# Altium schematic sheet BuzzerCircuit.SchDoc
size A
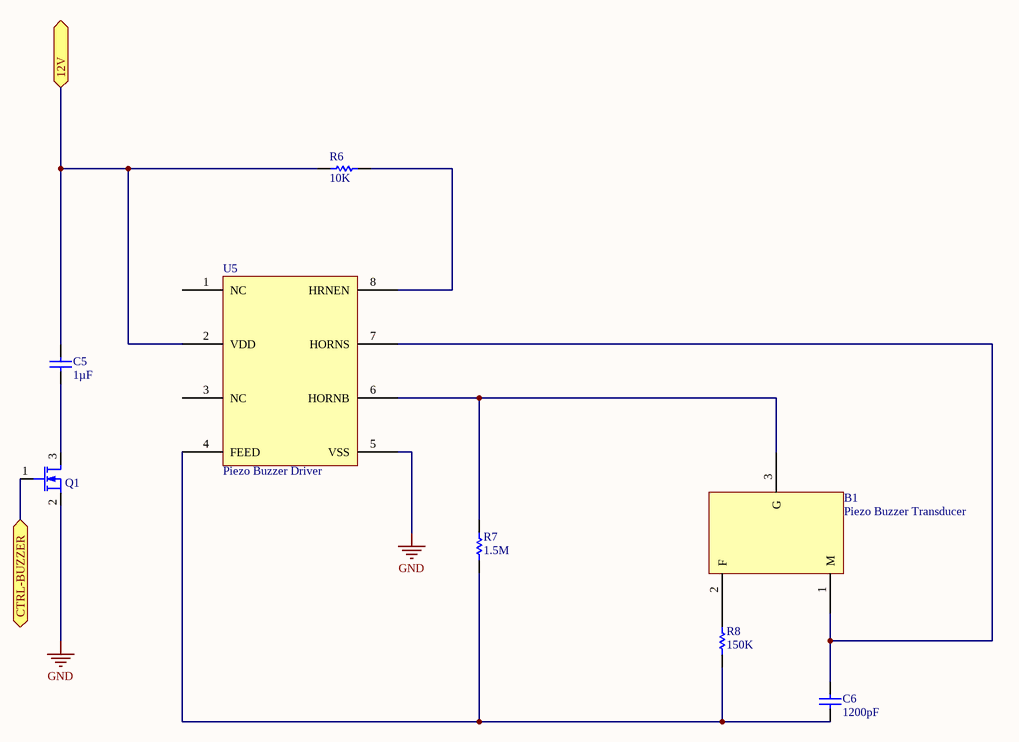
[diagram p0: BuzzerCircuit.SchDoc]

## Parts
B1  Piezo Buzzer Transducer  [2017 Buzzer]
C5  1µF  [0603]
C6  1200pF  [0603]
Q1  NMOS - MTM232270LBF  [MTM232270LBF]  (value not drawn)
R6  10K  [0603]
R7  1.5M  [0603]
R8  150K  [0603]
U5  Piezo Buzzer Driver  [Buzzer Driver]

## Ports
12V, CTRL-BUZZER

## Nets
GND: Q1.2 U5.5(VSS)
12V: C5.2 R6.1 U5.2(VDD) ; port 12V
CTRL-BUZZER: Q1.1 ; port CTRL-BUZZER
NetB1_1: B1.1(M) C6.2 U5.7(HORNS)
NetB1_2: B1.2(F) R8.2
NetB1_3: B1.3(G) R7.2 U5.6(HORNB)
NetC5_1: C5.1 Q1.3
NetC6_1: C6.1 R7.1 R8.1 U5.4(FEED)
NetR6_2: R6.2 U5.8(HRNEN)

Not connected (* = marked no-connect by the designer): U5 1(NC) 3(NC)

## Library data of the parts
C5 C6 = Cap: Capacitor; Published: 8-Jun-2000; LatestRevisionDate: 17-Jul-2002; LatestRevisionNote: Re-released for DXP Platform.; PackageReference: RAD-0.3; Publisher: Altium Limited; PackageDescription: Radial Cap, Thru-Hole; 2 Leads; 0.3 in Pin Spacing
  C5: Value: 1µF
  C6: Value: 1200pF
R6-R8 = Res1: Resistor; Published: 8-Jun-2000; LatestRevisionDate: 17-Jul-2002; LatestRevisionNote: Re-released for DXP Platform.; PackageReference: AXIAL-0.3; Publisher: Altium Limited; PackageDescription: Axial Device, Thru-Hole; 2 Leads; 0.3 in Pin Spacing
  R6: Value: 10K
  R7: Value: 1.5M
  R8: Value: 150K